# EAGLE design stm8s003 (EAGLE 7.5.0)
CNAME: STM8S003 CORE BORAD; CREVISION: 1.0; DESIGNER: HW WONG
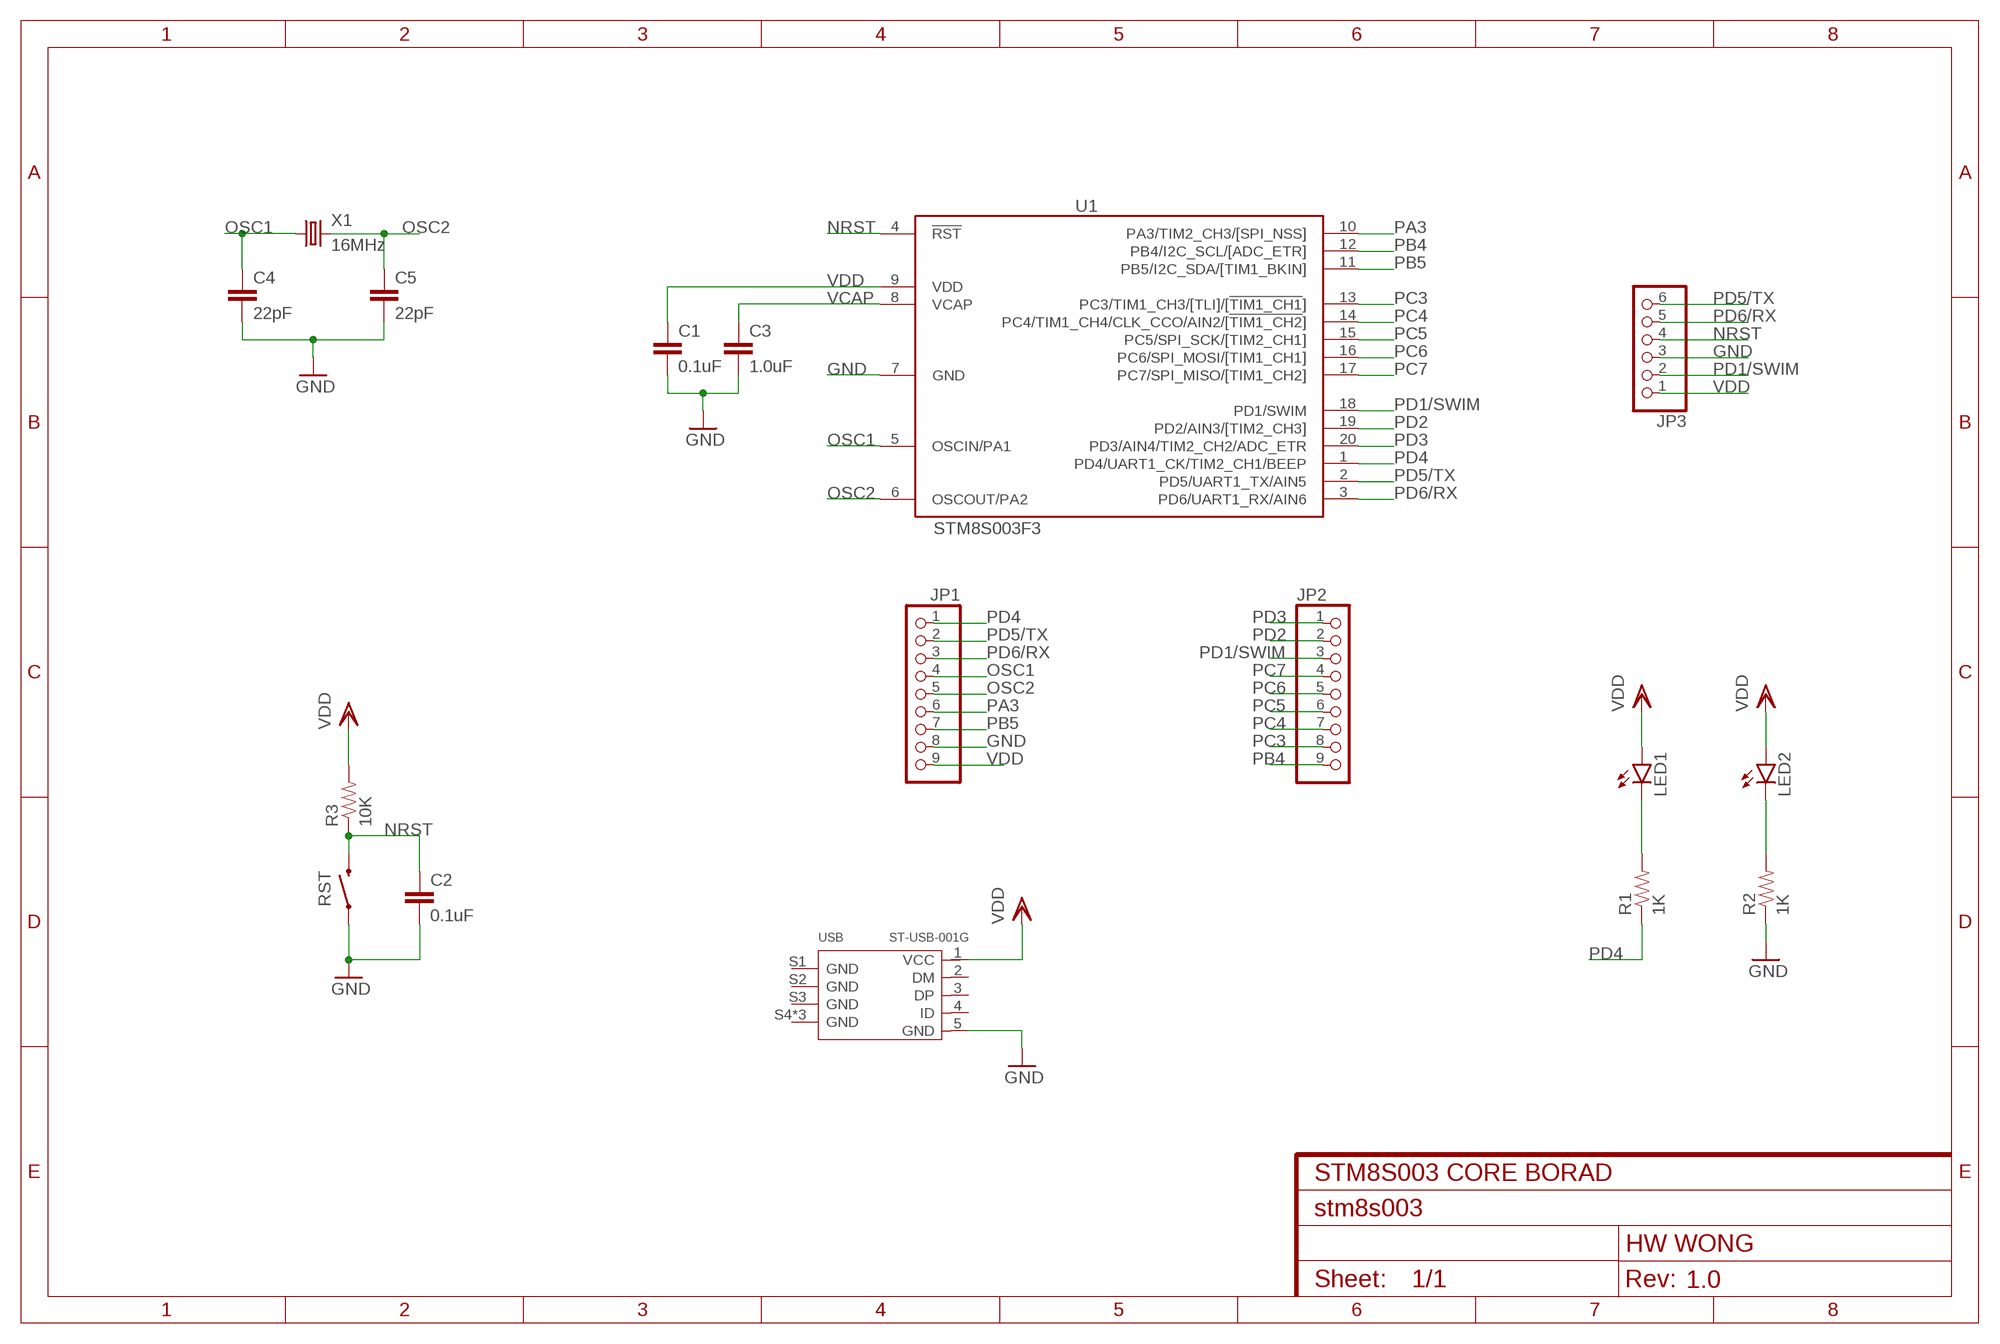
[diagram p0: schematic, sheet 1]

## Parts
C1  0.1uF  0.1UF-25V-5%(0603)  [0603-CAP]
C2  0.1uF  0.1UF-25V-5%(0603)  [0603-CAP]
C3  1.0uF  1.0UF-16V-10%(0603)  [0603-CAP]
C4  22pF  22PF-50V-5%(0603)  [0603-CAP]
C5  22pF  22PF-50V-5%(0603)  [0603-CAP]
JP1  PINHD-1X9  [1X09-BIG]
JP2  PINHD-1X9  [1X09-BIG]
JP3  PINHD-1X6  [1X06]
LED1  LED0603  [LED-0603]
LED2  LED0603  [LED-0603]
R1  1K  1KOHM-1/10W-1%(0603)  [0603-RES]
R2  1K  1KOHM-1/10W-1%(0603)  [0603-RES]
R3  10K  10KOHM-1/10W-1%(0603)0603  [0603-RES]
RST  SWITCH-MOMENTARY-2SMD-1101NE  [TACTILE-SWITCH-1101NE]
U1  STM8S003F3  [TSSOP20]
USB  ST-USB-001G  MICRO-USB-SMD-B-WITHOUT-POST-W/P(ST-USB-001G)  [MICRO-USB5+4P-SMD-0.65-B]
X1  16MHz  CRYSTALHC49US  [HC49US]

## Nets
GND: C1.2 C2.2 C3.2 C4.2 C5.2 JP1.8 JP3.3 R2.1 RST.1 U1.7(GND) USB.5(GND)
N$1: LED1.C R1.2
N$2: LED2.C R2.2
NRST: C2.1 JP3.4 R3.1 RST.2 U1.4(!RST)
OSC1: C4.1 JP1.4 U1.5(OSCIN/PA1) X1.1
OSC2: C5.1 JP1.5 U1.6(OSCOUT/PA2) X1.2
PA3: JP1.6 U1.10(PA3/TIM2_CH3/[SPI_NSS])
PB4: JP2.9 U1.12(PB4/I2C_SCL/[ADC_ETR])
PB5: JP1.7 U1.11(PB5/I2C_SDA/[TIM1_BKIN])
PC3: JP2.8 U1.13(PC3/TIM1_CH3/[TLI]/[!TIM1_CH1!])
PC4: JP2.7 U1.14(PC4/TIM1_CH4/CLK_CCO/AIN2/[!TIM1_CH2!])
PC5: JP2.6 U1.15(PC5/SPI_SCK/[TIM2_CH1])
PC6: JP2.5 U1.16(PC6/SPI_MOSI/[TIM1_CH1])
PC7: JP2.4 U1.17(PC7/SPI_MISO/[TIM1_CH2])
PD1/SWIM: JP2.3 JP3.2 U1.18(PD1/SWIM)
PD2: JP2.2 U1.19(PD2/AIN3/[TIM2_CH3])
PD3: JP2.1 U1.20(PD3/AIN4/TIM2_CH2/ADC_ETR)
PD4: JP1.1 R1.1 U1.1(PD4/UART1_CK/TIM2_CH1/BEEP)
PD5/TX: JP1.2 JP3.6 U1.2(PD5/UART1_TX/AIN5)
PD6/RX: JP1.3 JP3.5 U1.3(PD6/UART1_RX/AIN6)
VCAP: C3.1 U1.8(VCAP)
VDD: C1.1 JP1.9 JP3.1 LED1.A LED2.A R3.2 U1.9(VDD) USB.1(VCC)
Unconnected: USB.2(DM) USB.3(DP) USB.4(ID) USB.S1(GND) USB.S2(GND) USB.S3(GND) USB.S4(GND) USB.S5(GND) USB.S6(GND)

## Library data of the parts
C1 C2 = SparkFun-Capacitors:0.1UF-25V-5%(0603): CAP-08604; PROD_ID: CAP-08604
C3 = SparkFun-Capacitors:1.0UF-16V-10%(0603): CAP-00868; PROD_ID: CAP-00868
C4 C5 = SparkFun-Capacitors:22PF-50V-5%(0603): CAP-07876; PROD_ID: CAP-07876
JP1 JP2 = adafruit:PINHD-1X9: Pin header 1x10 0.1" spacing With round pins
JP3 = adafruit:PINHD-1X6: PIN HEADER
LED1 LED2 = SparkFun-LED:LED: LEDs Standard schematic elements and footprints for 5mm, 3mm, 1206, and 0603 sized LEDs. 5mm - Spark Fun Electronics SKU : COM-00529 (and others)
R1 R2 = SparkFun-Resistors:1KOHM-1/10W-1%(0603): RES-07856; PROD_ID: RES-07856
R3 = SparkFun-Resistors:10KOHM-1/10W-1%(0603): RES-00824; PROD_ID: RES-00824
RST = SparkFun-Electromechanical:SWITCH-MOMENTARY-2: Various NO switches- pushbuttons, reed, etc; PROD_ID: SWCH-00815
U1 = stm8:STM8S003: Value line, 16 MHz STM8S 8-bit MCU, 8 Kbytes Flash, 128 bytes data EEPROM, 10-bit ADC, 3 timers, UART, SPI, I2C
USB = Seeed-OPL-Connector:MICRO-USB-SMD-B-WITHOUT-POST-W/P(ST-USB-001G): 320010000; MPN: ST-USB-001G
X1 = SparkFun-FreqCtrl:CRYSTAL: Various standard crystals. Proven footprints.

## Net classes
0 default: clearance 0.205 mm

## Board
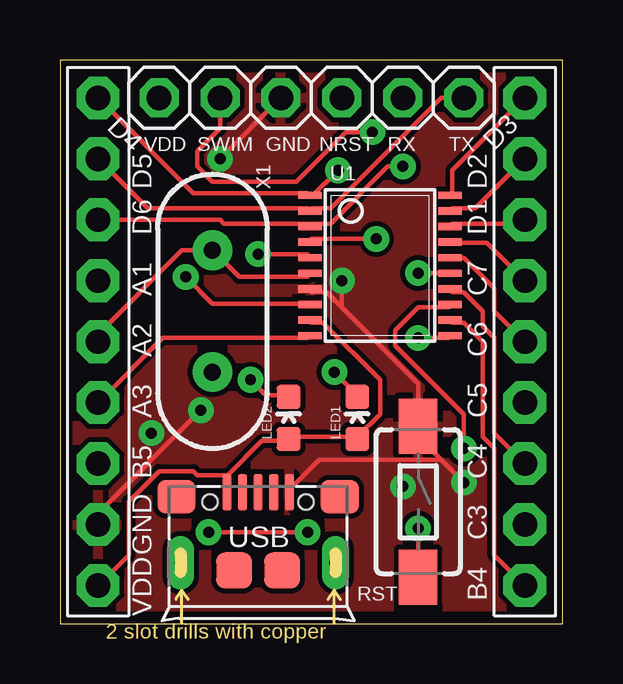
[diagram p1: board, top side]
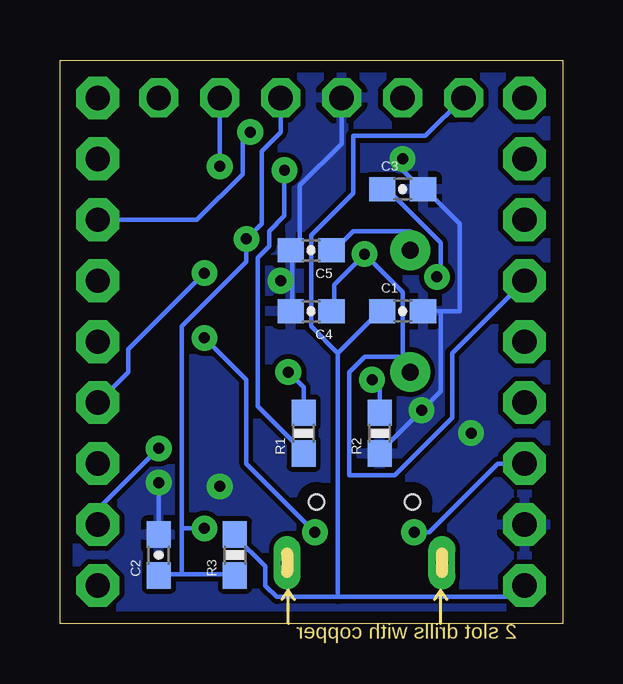
[diagram p2: board, bottom side, seen from below]

Size 20.94 x 23.48 mm. Coordinates in mm from the lower left corner, seen from the top.
Outline: 0,0 20.94,0 20.94,23.48 0,23.48 0,0
Copper layers (1*16): Top 0.035mm / dielectric 1.5mm / Bottom 0.035mm
Design rules "default *": minimum track width 7mil, minimum drill 18mil, track to track 8mil, track to pad 8mil, pad to pad 8mil, via to via 8mil, smd to smd 8mil, copper to edge 20mil, drill to drill 10mil, minimum pad ring 12mil, minimum via ring 12mil, stop-mask expansion 4mil, vias tented up to drill 0mil, thermal gap 10mil

### Footprints (pad centres in the part's own frame; a part is rotated, then mirrored left to right if it is on the bottom)
0603-CAP = smd 1.1 x 1: 1 -0.85,0; 2 0.85,0
1X09-BIG = drill 1.016 pad 1.778 octagon: 1 -10.16,0; 2 -7.62,0; 3 -5.08,0; 4 -2.54,0; 5 0,0; 6 2.54,0; 7 5.08,0; 8 7.62,0; 9 10.16,0
1X06 = drill 1.016 octagon: 1 -6.35,0; 2 -3.81,0; 3 -1.27,0; 4 1.27,0; 5 3.81,0; 6 6.35,0
LED-0603 = smd 1 x 1: A 0,-0.877; C 0,0.877
0603-RES = smd 1.1 x 1: 1 -0.85,0; 2 0.85,0
TACTILE-SWITCH-1101NE = smd 2.3 x 1.6: 1 -3.15,0; 2 3.15,0
TSSOP20 = smd 0.305 x 0.991: 1 -2.925,-2.918; 2 -2.275,-2.918; 3 -1.625,-2.918; 4 -0.975,-2.918; 5 -0.325,-2.918; 6 0.325,-2.918; 7 0.975,-2.918; 8 1.625,-2.918; 9 2.275,-2.918; 10 2.925,-2.918; 11 2.925,2.918; 12 2.275,2.918; 13 1.625,2.918; 14 0.975,2.918; 15 0.325,2.918; 16 -0.325,2.918; 17 -0.975,2.918; 18 -1.625,2.918; 19 -2.275,2.918; 20 -2.925,2.918
MICRO-USB5+4P-SMD-0.65-B = smd 0.381 x 1.524: 1 -1.3,-0.25; 2 -0.65,-0.25; 3 0,-0.25; 4 0.65,-0.25; 5 1.3,-0.25 | smd 1.6 x 1.397: S1 -3.4,-0.427; S6 3.4,-0.427 | drill 0.508 pad 1.016 long: S2 -3.226,-3.175; S5 3.226,-3.175 | smd 1.5 x 1.5: S3 -1,-3.5; S4 1,-3.5 | hole 0.635: -2,-0.65; 2,-0.65
HC49US = drill 0.7 pad 1.651: 1 -2.54,0; 2 2.54,0

### Placement (x,y rotation side)
C1  6.67,13.02 0 bottom
C2  16.83,2.86 90 bottom
C3  6.67,18.1 0 bottom
C4  10.48,13.02 180 bottom
C5  10.48,15.56 180 bottom
JP1  1.59,11.75 270 top
JP2  19.37,11.75 270 top
JP3  10.48,21.91 0 top
LED1  12.38,8.57 0 top
LED2  9.52,8.57 0 top
R1  10.79,7.94 90 bottom
R2  7.62,7.94 90 bottom
R3  13.65,2.86 90 bottom
RST  14.92,5.08 270 top
U1  13.33,14.92 270 top
USB  8.25,5.71 0 top
X1  6.35,13.02 90 top

### Tracks (layer width: path | path; a pad name or v marks a point on that pad's centre or on a via)
GND  (via drill 0.46, 0.46 pad 0.61)
  Top 0.178: JP1.8 1.59,4.6 v5.87,8.89 | 11.75,13.18 14.92,10 RST.1 14.92,7.78 15.88,6.83 | 11.75,13.18 11.11,13.81 10.48,13.81 U1.7 | 15.88,6.83 v16.83,5.87 | 15.88,6.83 10.8,6.83 9.52,5.56 USB.5 | 11.75,13.18 v11.75,14.29 | JP3.3 v6.67,19.37
  Bottom 0.178: 5.08,13.02 4.29,13.02 4.29,16.67 5.72,18.1 C3.2 5.87,18.1 6.67,18.89 v6.67,19.37 | 5.08,13.02 C1.2 | 5.08,13.02 5.08,9.68 v5.87,8.89 7.62,7.14 R2.1 | 11.27,15.56 11.27,14.29 | 11.27,14.29 11.27,13.02 C4.2 | 11.27,15.56 10.95,15.87 10.95,18.26 9.21,20 JP3.3 | 11.27,15.56 C5.2 | v16.83,5.87 C2.2 | v11.75,14.29 11.27,14.29
  other vias: 14.29,5.71 3.81,7.94
  pour Top: 0.32,23.18 20.64,23.18 20.64,0.32 0.32,0.32
  pour Bottom: 0.32,23.18 20.64,23.18 20.64,0.32 0.32,0.32
N$1  (via drill 0.46)
  Top 0.178: v11.43,10.48 12.38,9.52 LED1.C
  Bottom 0.178: v11.43,10.48 10.8,9.84 R1.2
N$2  (via drill 0.46)
  Top 0.178: v7.94,10.16 8.57,9.52 9.52,9.52 LED2.C
  Bottom 0.178: v7.94,10.16 7.62,9.84 R2.2
NRST  (via drill 0.46)
  Top 0.178: v13.18,16.03 10.48,16.03 U1.4 | v14.92,3.97 RST.2
  Bottom 0.178: 15.88,2.06 16.83,2.06 C2.1 | 15.88,2.06 13.65,2.06 R3.1 | JP3.4 11.75,20.48 12.54,19.69 12.54,16.67 v13.18,16.03 13.18,15.08 15.88,12.38 15.88,3.97 | 15.88,3.97 15.88,2.06 | 15.88,3.97 v14.92,3.97
OSC1  (via drill 0.46)
  Top 0.178: v8.25,15.4 10.32,15.4 U1.5
  Bottom 0.178: C4.1 9.52,13.02 9.52,14.13 v8.25,15.4 6.67,13.81 6.67,11.11 | 6.67,11.11 6.67,10.79 X1.1 6.67,11.11 | JP1.4 4.6,11.27 4.6,8.57 6.99,6.19 8.89,6.19 8.89,10.48 8.25,11.11 6.67,11.11
OSC2
  Top 0.178: U1.6 10.32,14.45 7.46,14.45 X1.2 5.08,15.56 1.59,12.07 JP1.5
  Bottom 0.178: X1.2 6.35,16.35 8.73,16.35 9.52,15.56 C5.1
PA3
  Top 0.178: JP1.6 4.29,11.91 10.32,11.91 U1.10
PB4
  Top 0.178: JP2.9 18.1,2.86 18.1,7.3 17.62,7.78 17.62,11.75 16.83,12.54 16.35,12.54 U1.12
PB5  (via drill 0.46)
  Top 0.178: v14.92,11.91 16.19,11.91 U1.11 | v6.19,3.81 v10.32,3.81
  Bottom 0.178: v14.92,11.91 13.18,10.16 13.18,6.67 v10.32,3.81 | v6.19,3.81 5.56,3.81 2.7,6.67 JP1.7
PC3  (via drill 0.46)
  Top 0.178: v16.83,7.3 16.83,8.73 13.97,11.59 13.97,12.22 14.92,13.18 16.19,13.18 U1.13
  Bottom 0.178: v16.83,7.3 19.37,4.76 JP2.8
PC4
  Top 0.178: JP2.7 18.1,7.94 18.1,11.91 17.62,12.38 17.62,13.02 16.83,13.81 16.35,13.81 U1.14
PC5  (via drill 0.46)
  Top 0.178: v14.92,14.6 16.19,14.6 U1.15
  Bottom 0.178: v14.92,14.6 18.1,11.43 18.1,10.48 JP2.6
PC6
  Top 0.178: JP2.5 18.1,13.02 18.1,13.97 16.83,15.24 16.35,15.24 U1.16
PC7
  Top 0.178: JP2.4 17.78,15.87 16.35,15.87 U1.17
PD1/SWIM  (via drill 0.46)
  Top 0.178: JP2.3 19.21,16.67 16.35,16.67 U1.18 | JP3.2 6.67,20.64 5.72,19.69 5.72,19.05 6.35,18.41 9.84,18.41 11.91,20.48 v13.02,20.48
  Bottom 0.178: v13.02,20.48 13.33,20.16 13.33,18.73 15.24,16.83 JP2.3
PD2
  Top 0.178: JP2.2 17.3,17.3 16.35,17.3 U1.19
PD3
  Top 0.178: JP2.1 16.35,18.89 16.35,17.94 U1.20
PD4  (via drill 0.46)
  Top 0.178: JP1.1 5.56,17.94 10.32,17.94 U1.1 10.48,17.78 v11.59,18.89
  Bottom 0.178: v11.59,18.89 11.59,16.99 12.22,16.35 12.22,15.72 12.7,15.24 12.7,9.05 10.8,7.14 R1.1
PD5/TX
  Top 0.178: JP1.2 3.65,17.3 10.32,17.3 U1.2 10.48,17.3 11.27,17.3 15.88,21.91 JP3.6
PD6/RX  (via drill 0.46)
  Top 0.178: JP1.3 6.67,16.83 6.83,16.67 10.32,16.67 U1.3 10.48,16.67 11.27,16.67 13.65,19.05 v14.29,19.05
  Bottom 0.178: v14.29,19.05 JP3.5
VCAP  (via drill 0.46)
  Top 0.178: v5.24,14.45 6.35,13.34 10.32,13.34 U1.8
  Bottom 0.178: v5.24,14.45 5.08,14.6 5.08,15.87 7.3,18.1 C3.1
VDD
  Top 0.178: 12.38,7.78 13.33,8.73 13.33,10.16 10.95,12.54 10.48,12.54 U1.9 | 12.38,7.78 9.52,7.78 LED2.A 9.52,7.62 8.41,7.62 6.99,6.19 | 12.38,7.78 LED1.A | 6.99,6.19 6.99,5.56 USB.1 6.99,6.19 | 6.99,6.19 5.72,6.19 5.56,6.35 4.13,6.35 2.86,5.08 2.86,2.86 JP1.9
  Bottom 0.178: 9.37,1.11 1.59,1.11 JP1.9 | 9.37,1.11 11.91,1.11 12.38,1.59 12.38,2.38 13.65,3.65 R3.2 | 9.37,11.27 7.62,13.02 C1.1 | 9.37,1.11 9.37,11.27 | JP3.1 5.72,20.32 8.73,20.32 8.73,17.94 10.48,16.19 10.48,12.38 9.37,11.27

### Text on the board
tNames: D4 | VDD | SWIM | GND | NRST | RX | TX | D3 | D5 | D2 | D6 | D1 | A1 | C7 | A2 | C6 | A3 | C5 | B5 | C4 | GND | C3 | B4 | VDD